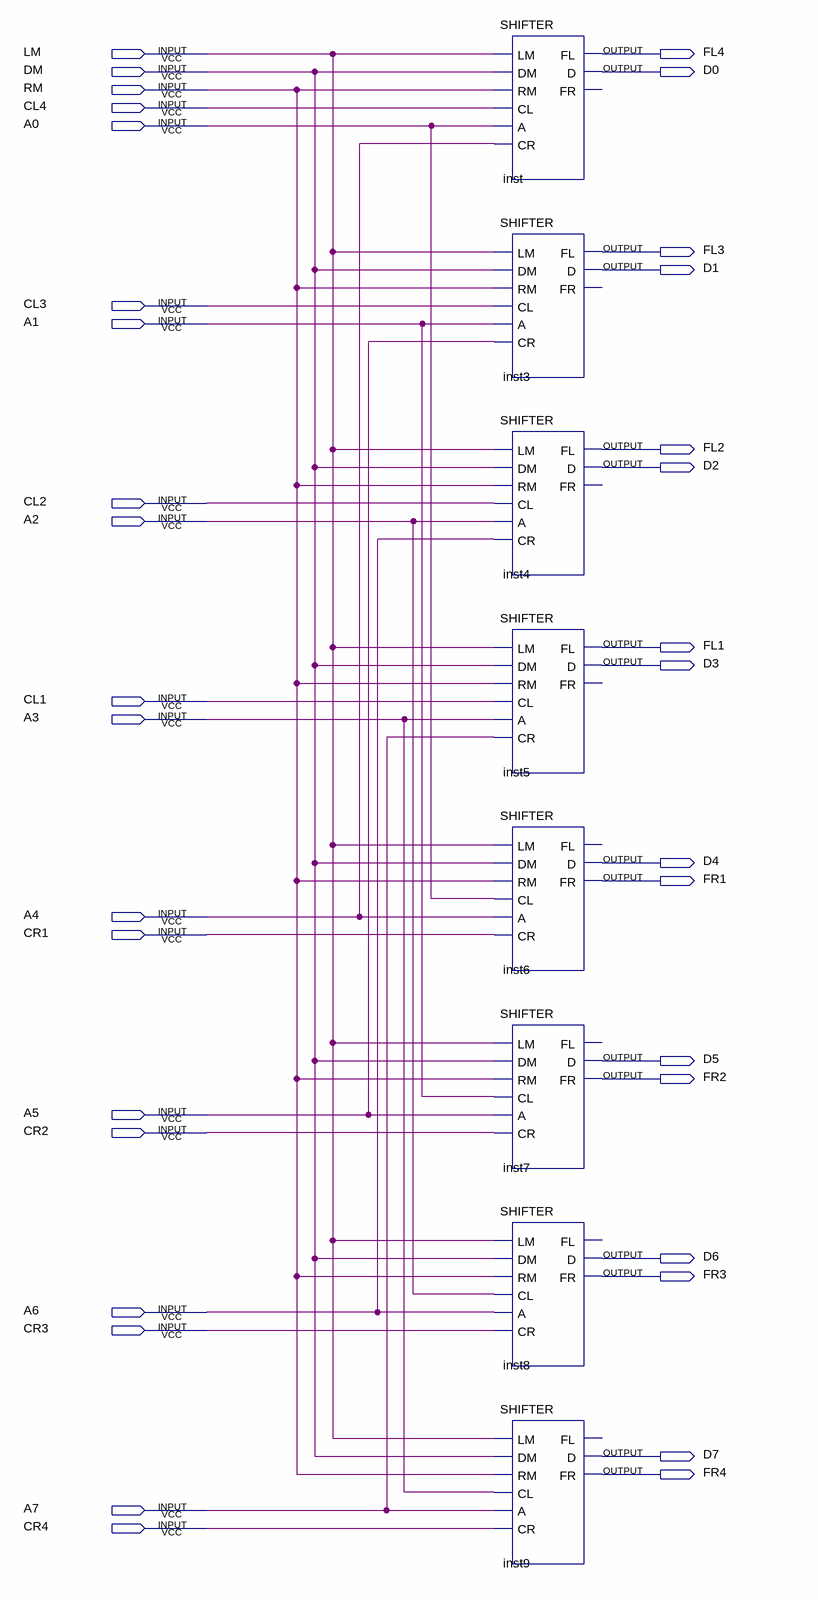
[diagram p0: schematic sheet]
// Quartus schematic SHIFTER8-4.bdf as structural Verilog: 8 symbols, 35 pins
module \SHIFTER8-4  (
  input  LM,
  input  DM,
  input  RM,
  input  CL4,
  input  A0,
  input  CL3,
  input  A1,
  input  CL2,
  input  A2,
  input  CL1,
  input  A3,
  input  A4,
  input  CR1,
  input  A5,
  input  CR2,
  input  A6,
  input  CR3,
  input  A7,
  input  CR4,
  output FL4,
  output D0,
  output FL3,
  output D1,
  output FL2,
  output D2,
  output FL1,
  output D3,
  output D4,
  output FR1,
  output D5,
  output FR2,
  output D6,
  output FR3,
  output D7,
  output FR4
);

  SHIFTER inst (.LM(LM), .DM(DM), .RM(RM), .CL(CL4), .A(A0), .CR(A4), .FL(FL4), .D(D0));  // open: FR
  SHIFTER inst3 (.LM(LM), .DM(DM), .RM(RM), .CL(CL3), .A(A1), .CR(A5), .FL(FL3), .D(D1));  // open: FR
  SHIFTER inst4 (.LM(LM), .DM(DM), .RM(RM), .CL(CL2), .A(A2), .CR(A6), .FL(FL2), .D(D2));  // open: FR
  SHIFTER inst5 (.LM(LM), .DM(DM), .RM(RM), .CL(CL1), .A(A3), .CR(A7), .FL(FL1), .D(D3));  // open: FR
  SHIFTER inst6 (.LM(LM), .DM(DM), .RM(RM), .CL(A0), .A(A4), .CR(CR1), .D(D4), .FR(FR1));  // open: FL
  SHIFTER inst7 (.LM(LM), .DM(DM), .RM(RM), .CL(A1), .A(A5), .CR(CR2), .D(D5), .FR(FR2));  // open: FL
  SHIFTER inst8 (.LM(LM), .DM(DM), .RM(RM), .CL(A2), .A(A6), .CR(CR3), .D(D6), .FR(FR3));  // open: FL
  SHIFTER inst9 (.LM(LM), .DM(DM), .RM(RM), .CL(A3), .A(A7), .CR(CR4), .D(D7), .FR(FR4));  // open: FL
endmodule
